# EAGLE design Main (EAGLE 7.1.0)
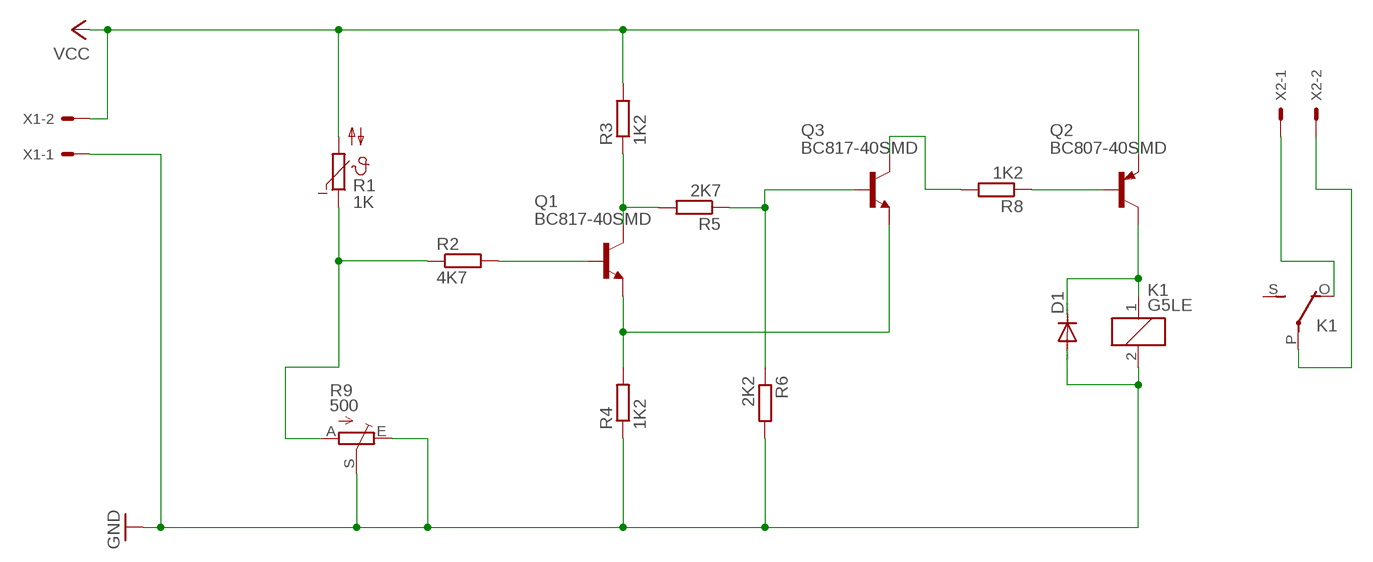
[diagram p0: schematic, sheet 1]

## Parts
D1  DIODE-DO214AC  [DO214AC]
K1  G5LE  [G5LE]
Q1  BC817-40SMD  [SOT23-BEC]
Q2  BC807-40SMD  [SOT23-BEC]
Q3  BC817-40SMD  [SOT23-BEC]
R1  1K  B57164  [B57164]
R2  4K7  R-EU_R1206  [R1206]
R3  1K2  R-EU_R1206  [R1206]
R4  1K2  R-EU_R1206  [R1206]
R5  2K7  R-EU_R1206  [R1206]
R6  2K2  R-EU_R1206  [R1206]
R8  1K2  R-EU_R1206  [R1206]
R9  500  TRIM_EU-CA14V  [CA14V]
X1  KK-156-2  [KK-156-2]
X2  KK-156-2  [KK-156-2]

## Nets
GND: D1.A K1.2 R4.1 R6.2 R9.E R9.S X1.1
N$1: D1.C K1.1 Q2.C
N$2: Q1.E Q3.E R4.2
N$3: R1.1 R2.1 R9.A
N$4: Q1.B R2.2
N$5: Q1.C R3.1 R5.2
N$6: Q3.B R5.1 R6.1
N$7: Q3.C R8.2
N$8: Q2.B R8.1
N$9: K1.O(2:O) X2.1
N$10: K1.P(2:P) X2.2
VCC: Q2.E R1.2 R3.2 X1.2
Unconnected: K1.S(2:S)

## Library data of the parts
D1 = diode:DIODE-: DIODE
K1 = relay:G5LE: RELAY 1 x switch, 10 A/120 V AC, 8 A/30 V DC, Omron; OC_FARNELL: unknown; OC_NEWARK: unknown
Q1 Q3 = transistor-npn:BC817*: NPN Transistor
Q2 = transistor-pnp:BC807*: PNP Transistror
R1 = ptc-ntc:B57164: SIEMENS NTC; MPN: B57164K474K52; OC_FARNELL: 9753451; OC_NEWARK: 29M3118
R2-R6 R8 = rcl:R-EU_: RESISTOR, European symbol
R9 = pot:TRIM_EU-: POTENTIOMETER
X1 X2 = con-molex:KK-156-2: KK 156 HEADER Source: http://www.molex.com/pdm_docs/sd/026604100_sd.pdf; OC_FARNELL: unknown; OC_NEWARK: unknown

## Board
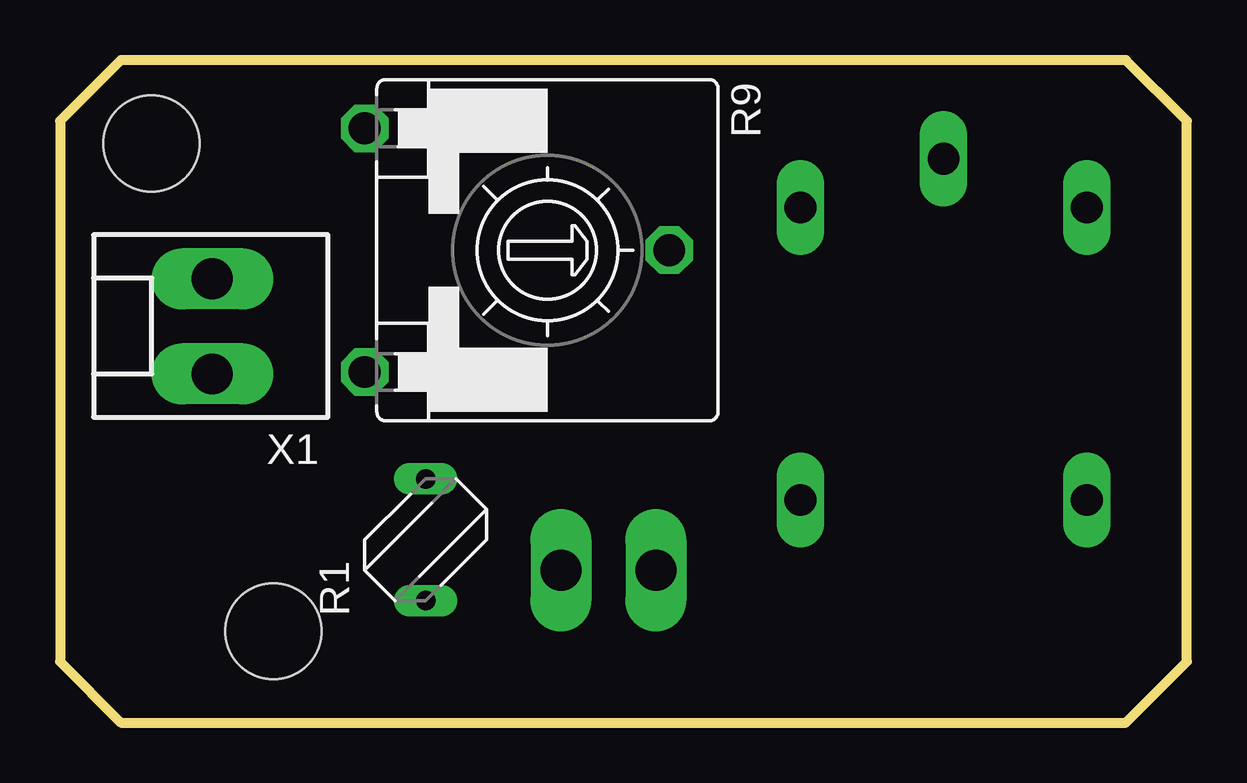
[diagram p1: board, top side]
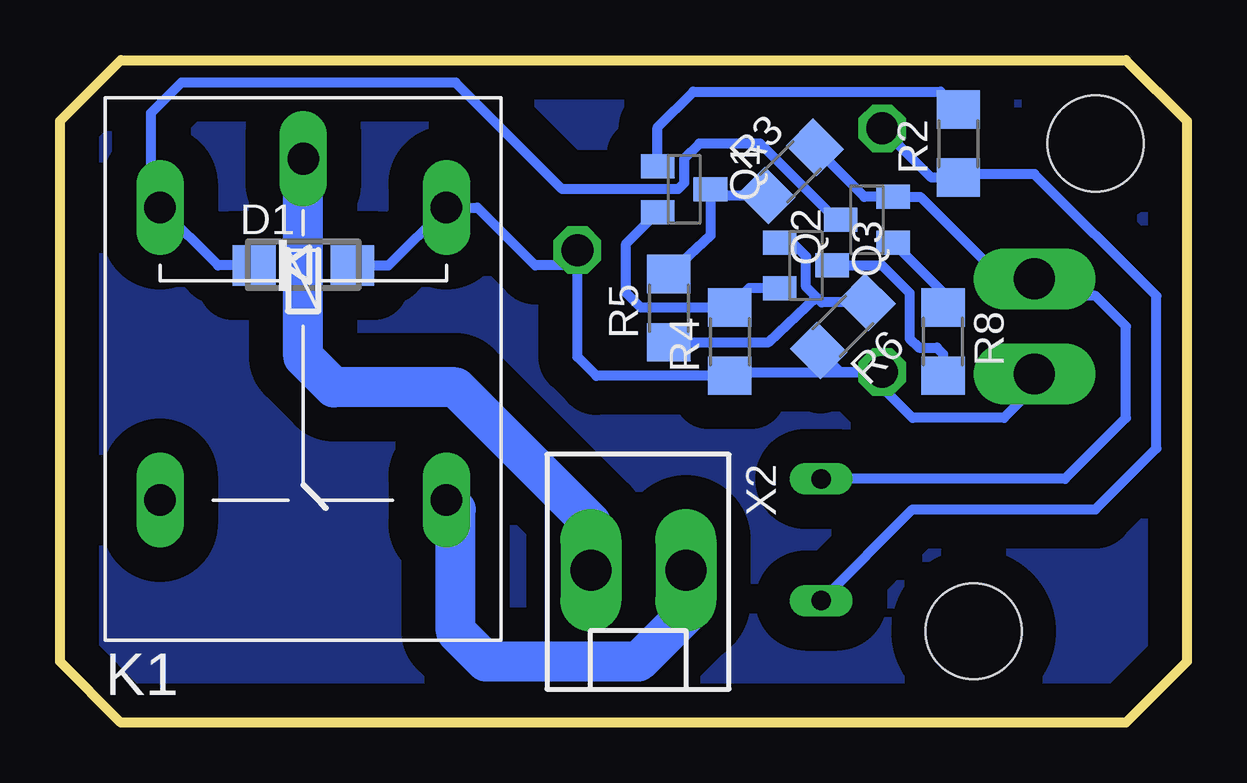
[diagram p2: board, bottom side, seen from below]

Size 46.97 x 27.61 mm. Coordinates in mm from the lower left corner, seen from the top.
Outline: 0,25.07 0,2.54 2.54,0 44.43,0 46.97,2.54 46.97,25.07 44.43,27.61 2.54,27.61 0,25.07
Copper layers (1*16): Top 0.035mm / dielectric 1.5mm / Bottom 0.035mm
Design rules "default": minimum track width 10mil, minimum drill 24mil, track to track 8mil, track to pad 8mil, pad to pad 8mil, via to via 8mil, smd to smd 8mil, copper to edge 40mil, drill to drill 8mil, minimum pad ring 10mil, minimum via ring 8mil, stop-mask expansion 4mil, vias tented up to drill 0mil, thermal gap 10mil
Holes 4 mm at 3.81,24.13 8.89,3.81

### Footprints (pad centres in the part's own frame; a part is rotated, then mirrored left to right if it is on the bottom)
DO214AC = smd 1.8 x 1.7: A 2.05,0; C -2.05,0
G5LE = drill 1.321 long: 1 -7.493,-5.969; 2 -7.493,5.969; O 4.699,5.969; P -9.525,0; S 4.699,-5.969
SOT23-BEC = smd 1 x 1.4: B -0.95,-1.1; C 0,1.1; E 0.95,-1.1
B57164 = drill 0.813 long: 1 -2.54,0; 2 2.54,0
R1206 = smd 1.6 x 1.803: 1 -1.422,0; 2 1.422,0
CA14V = drill 1.321 octagon: A -5.08,-7.62; E 5.08,-7.62; S 0,5.08
KK-156-2 = drill 1.7 pad 2.184 long: 1 -1.98,0; 2 1.98,0

### Placement (x,y rotation side)
D1  36.83,19.05 0 bottom
K1  36.83,13.97 270 bottom
Q1  20.95,22.23 270 bottom
Q2  13.34,20.95 90 bottom
Q3  15.88,19.05 270 bottom
R1  15.24,7.62 90 top
R2  9.53,24.13 90 bottom
R3  16.51,22.97 45 bottom
R4  19.05,15.88 90 bottom
R5  21.59,17.27 90 bottom
R6  14.34,16.51 225 bottom
R8  10.16,15.88 270 bottom
R9  20.32,19.68 270 top
X1  6.35,16.51 90 top
X2  22.86,6.35 180 bottom

### Tracks (layer width: path | path; a pad name or v marks a point on that pad's centre or on a via)
GND
  Bottom 0.406: X1.1 6.35,13.97 7.62,12.7 11.43,12.7 12.7,13.97 R9.E | R9.E 14.45,14.61 R6.2 | 25.4,19.05 25.4,15.24 24.61,14.45 R4.1 18.9,14.61 R9.E | 25.4,19.05 R9.S 25.4,19.05 | 25.4,19.05 27.16,19.05 29.57,21.46 K1.2 33.27,19.05 D1.A
N$1
  Bottom 0.406: Q2.C 14.61,20.95 17.78,24.13 20.32,24.13 20.95,23.5 20.95,22.48 21.21,22.23 26.04,22.23 30.48,26.67 41.91,26.67 43.18,25.4 43.18,21.84 K1.1 40.39,19.05 D1.C
N$2
  Bottom 0.406: Q3.E 18.25,18.1 R4.2 22.76,17.3 23.37,17.91 23.37,19.96 Q1.E
N$3
  Bottom 0.406: R9.A 10.64,22.71 R2.1 9.37,22.86 6.35,22.86 1.27,17.78 1.27,11.43 3.81,8.89 11.43,8.89 R1.1
N$4
  Bottom 0.406: Q1.B 22.05,24.81 20.57,26.29 10.26,26.29 R2.2
N$5
  Bottom 0.406: R5.2 19.86,20.3 Q1.C 19.59,21.96 R3.1
N$6
  Bottom 0.406: R6.1 15.23,17.52 15.43,17.72 | 15.43,17.72 15.88,18.16 15.88,19.43 16.38,19.94 16.91,19.94 Q3.B | R5.1 17.42,15.85 15.43,17.72
N$7
  Bottom 0.406: Q3.C 12.7,19.05 11.56,17.91 11.56,16 11.18,15.62 10.41,15.62 10.16,15.37 R8.2 10.31,14.61 10.79,14.61
N$8
  Bottom 0.406: R8.1 10.16,17.93 Q2.B
N$9
  Bottom 1.676: X2.1 20.88,4.52 22.86,2.54 29.21,2.54 30.48,3.81 30.48,8.89 K1.O
N$10
  Bottom 1.676: X2.2 24.84,8.33 30.48,13.97 35.56,13.97 36.83,15.24 K1.P
N$11
  pour Bottom (isolate 1.422): 0,2.54 0,25.4 2.54,27.94 44.45,27.94 46.99,25.4 46.99,2.54 44.45,0 2.54,0
VCC
  Bottom 0.406: R3.2 13.44,21.91 Q2.E 11.11,21.91 8.26,19.05 6.91,19.05 X1.2 5.64,17.78 3.81,17.78 2.54,16.51 2.54,12.7 5.08,10.16 R1.2